# Altium schematic sheet HashPower2.SchDoc: ANT_Miner_V1.3
size A4; Date: 2013/11/20; DrawnBy: Bitmain Technology; SheetNumber: 3; SheetTotal: 9
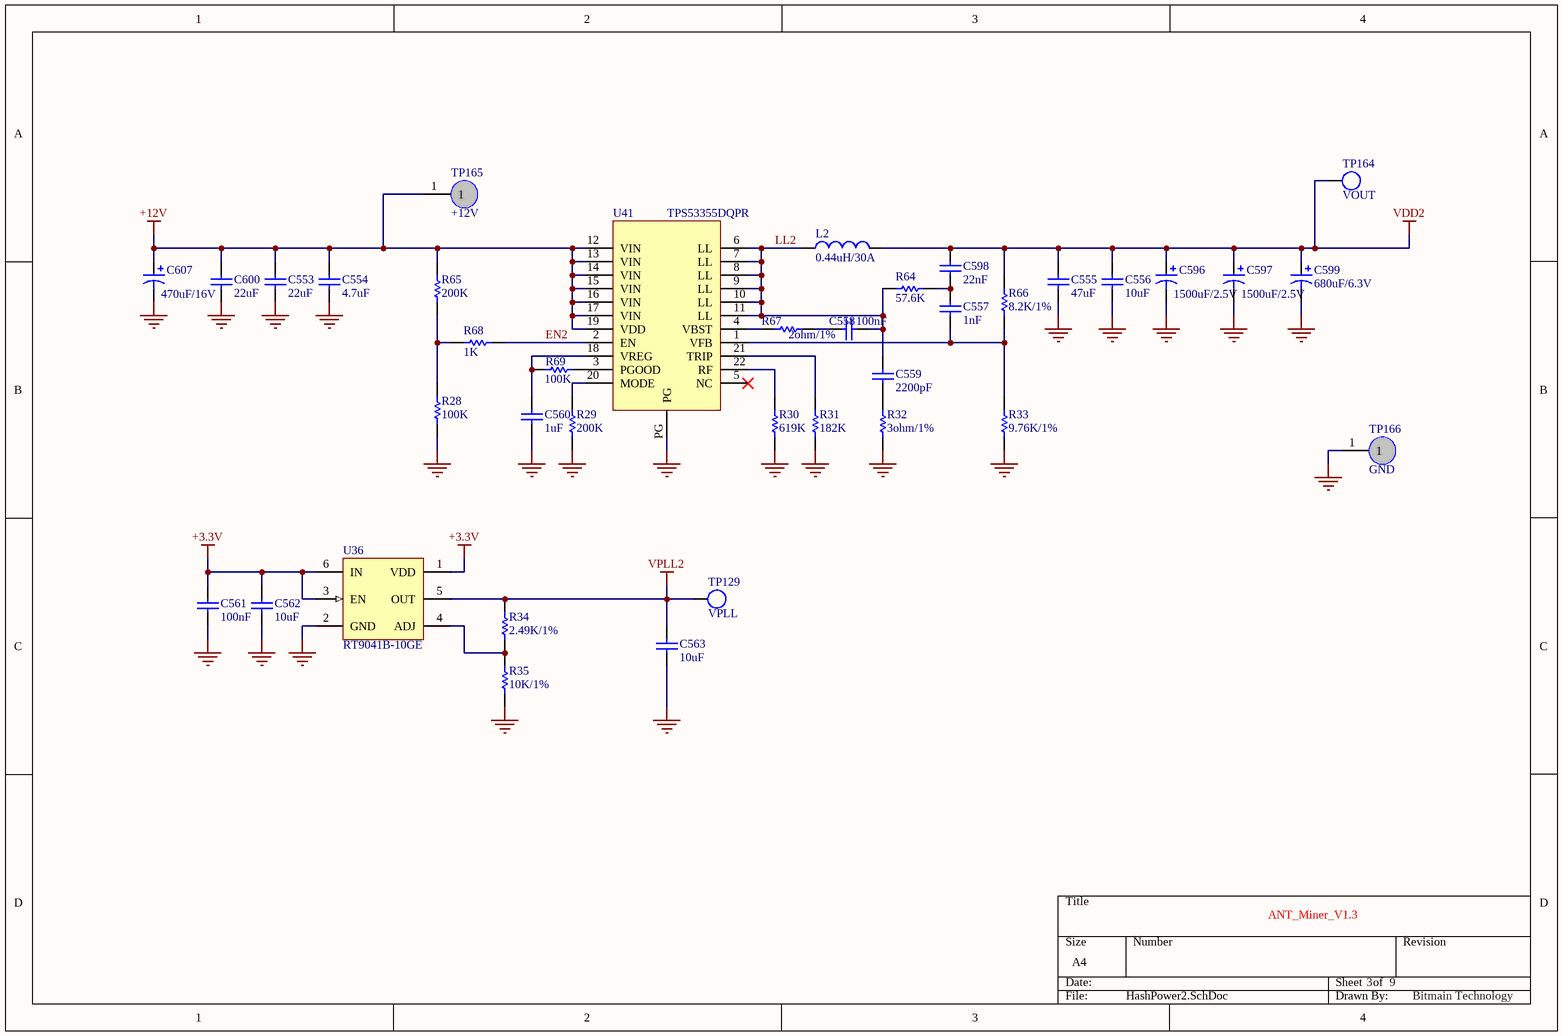
[diagram p0: HashPower2.SchDoc]

## Parts
C553  22uF  [CC1210(3225)]
C554  4.7uF  [CC0805(2012)]
C555  47uF  [CAPC3225L]
C556  10uF  [CAPC2012L]
C557  1nF  [CC0603(1608)]
C558  100nF  [CC0603(1608)]
C559  2200pF  [CC0603(1608)]
C560  1uF  [CC0603(1608)]
C561  100nF  [CC0603(1608)]
C562  10uF  [CC0805(2012)]
C563  10uF  [CC0805(2012)]
C596  value 1500uF/2.5V  [F12]  (hidden comment: 1500uF/4V)
C597  value 1500uF/2.5V  [F12]  (hidden comment: 1500uF/4V)
C598  22nF  [CC0603(1608)]
C599  680uF/6.3V  [D]
C600  22uF  [CC1210(3225)]
C607  470uF/16V  [E12]
L2  0.44uH/30A  [IHLP5050]
R28  100K  [RR0603(1608)]
R29  200K  [RR0603(1608)]
R30  619K  [RR0603(1608)]
R31  182K  [RR0603(1608)]
R32  value 3ohm/1%  [RR0603(1608)]  (hidden comment: 3)
R33  9.76K/1%  [RR0603(1608)]
R34  2.49K/1%  [RR0603(1608)]
R35  10K/1%  [RR0603(1608)]
R64  57.6K  [RR0603(1608)]
R65  200K  [RR0603(1608)]
R66  8.2K/1%  [RR0603(1608)]
R67  value 2ohm/1%  [RR0603(1608)]  (hidden comment: 2)
R68  1K  [RR0603(1608)]
R69  100K  [RR0603(1608)]
TP129  VPLL  [TP_SMD_1.0]
TP164  VOUT  [TP_SMD_1.0]
TP165  +12V  [TP]
TP166  GND  [TP]
U36  RT9041B-10GE  [SOT23-6_L]
U41  TPS53355DQPR  [TPS53355]

## Nets
+3.3V: C561.2 C562.2 U36.1(VDD) U36.3(EN) U36.6(IN)
+12V: C553.1 C554.1 C600.1 C607.1 R65.1 TP165.1 U41.12(VIN) U41.13(VIN) U41.14(VIN) U41.15(VIN) U41.16(VIN) U41.17(VIN) U41.19(VDD)
GND: C553.2 C554.2 C555.1 C556.1 C560.2 C561.1 C562.1 C563.1 C596.2 C597.2 C599.2 C600.2 C607.2 R28.2 R29.2 R30.2 R31.2 R32.2 R33.2 R35.1 TP166.1 U36.2(GND) U41.PG
VDD2: C555.2 C556.2 C596.1 C597.1 C598.1 C599.1 L2.2 R66.1 TP164.1
VPLL2: C563.2 R34.2 TP129.1 U36.5(OUT)
EN2: R68.2 U41.2(EN)
LL2: C558.2 C559.1 L2.1 R64.1 U41.6(LL) U41.7(LL) U41.8(LL) U41.9(LL) U41.10(LL) U41.11(LL)
NetC557_1: C557.1 C598.2 R64.2
NetC557_2: C557.2 R33.1 R66.2 U41.1(VFB)
NetC558_1: C558.1 R67.2
NetC559_2: C559.2 R32.1
NetC560_1: C560.1 R69.1 U41.18(VREG)
NetR28_1: R28.1 R65.2 R68.1
NetR29_1: R29.1 U41.20(MODE)
NetR30_1: R30.1 U41.22(RF)
NetR31_1: R31.1 U41.21(TRIP)
NetR34_1: R34.1 R35.2 U36.4(ADJ)
NetR67_1: R67.1 U41.4(VBST)
NetR69_2: R69.2 U41.3(PGOOD)

Not connected (* = marked no-connect by the designer): U41 5(NC)*

## Library data of the parts
C553 C554 C557-C560 C598 C600 = Cap: Capacitor
  C553 C600: Value: 22uF
  C554: Value: 4.7uF
  C557: Value: 1nF
  C558: Value: 100nF
  C559: Value: 2200pF
  C560: Value: 1uF
  C598: Value: 22nF
C555 C556 C561-C563 = Cap Semi: Capacitor (Semiconductor SIM Model); Published: 8-Jun-2000; LatestRevisionDate: 29-May-2009; LatestRevisionNote: IPC-7351 Footprint Added.; PackageReference: C1206; Publisher: Altium Limited; PackageDescription: Chip Capacitor
  C555: Value: 47uF
  C556 C562 C563: Value: 10uF
  C561: Value: 100nF
C596 C597 C607 = Cap Pol2: Polarized Capacitor (SMD)
  C607: Value: 470uF/16V
C599 = Cap Pol3: Polarized Capacitor (Surface Mount); Published: 8-Jun-2000; LatestRevisionDate: 29-May-2009; LatestRevisionNote: IPC-7351 Footprint Added.; PackageReference: C0805; Publisher: Altium Limited; PackageDescription: Chip Capacitor; Value: 680uF/6.3V
L2 = Inductor: Code_IEC: 1005; Published: 8-Jun-2000; LatestRevisionDate: 29-May-2009; LatestRevisionNote: IPC-7351 Footprint Added.; PackageReference: 0402-A; Publisher: Altium Limited; PackageDescription: Chip Inductor; Code_JEITA: 0402; Value: 0.44uH/30A
R28-R35 R64-R69 = Res1: Resistor
  R28 R69: Value: 100K
  R29 R65: Value: 200K
  R30: Value: 619K
  R31: Value: 182K
  R33: Value: 9.76K/1%
  R34: Published: 8-Jun-2000; LatestRevisionDate: 17-Jul-2002; LatestRevisionNote: Re-released for DXP Platform.; PackageReference: AXIAL-0.3; Publisher: Altium Limited; PackageDescription: Axial Device, Thru-Hole; 2 Leads; 0.3 in Pin Spacing; Value: 2.49K/1%
  R35: Published: 8-Jun-2000; LatestRevisionDate: 17-Jul-2002; LatestRevisionNote: Re-released for DXP Platform.; PackageReference: AXIAL-0.3; Publisher: Altium Limited; PackageDescription: Axial Device, Thru-Hole; 2 Leads; 0.3 in Pin Spacing; Value: 10K/1%
  R64: Value: 57.6K
  R66: Value: 8.2K/1%
  R68: Value: 1K
TP129 TP164 = TP: Test Point
  TP129: Value: VPLL
  TP164: Value: VOUT
TP165 TP166 = TP
U41 = TPS53355